# Altium project 3DAS_4Camera.PrjPcb (part 10 of 10)
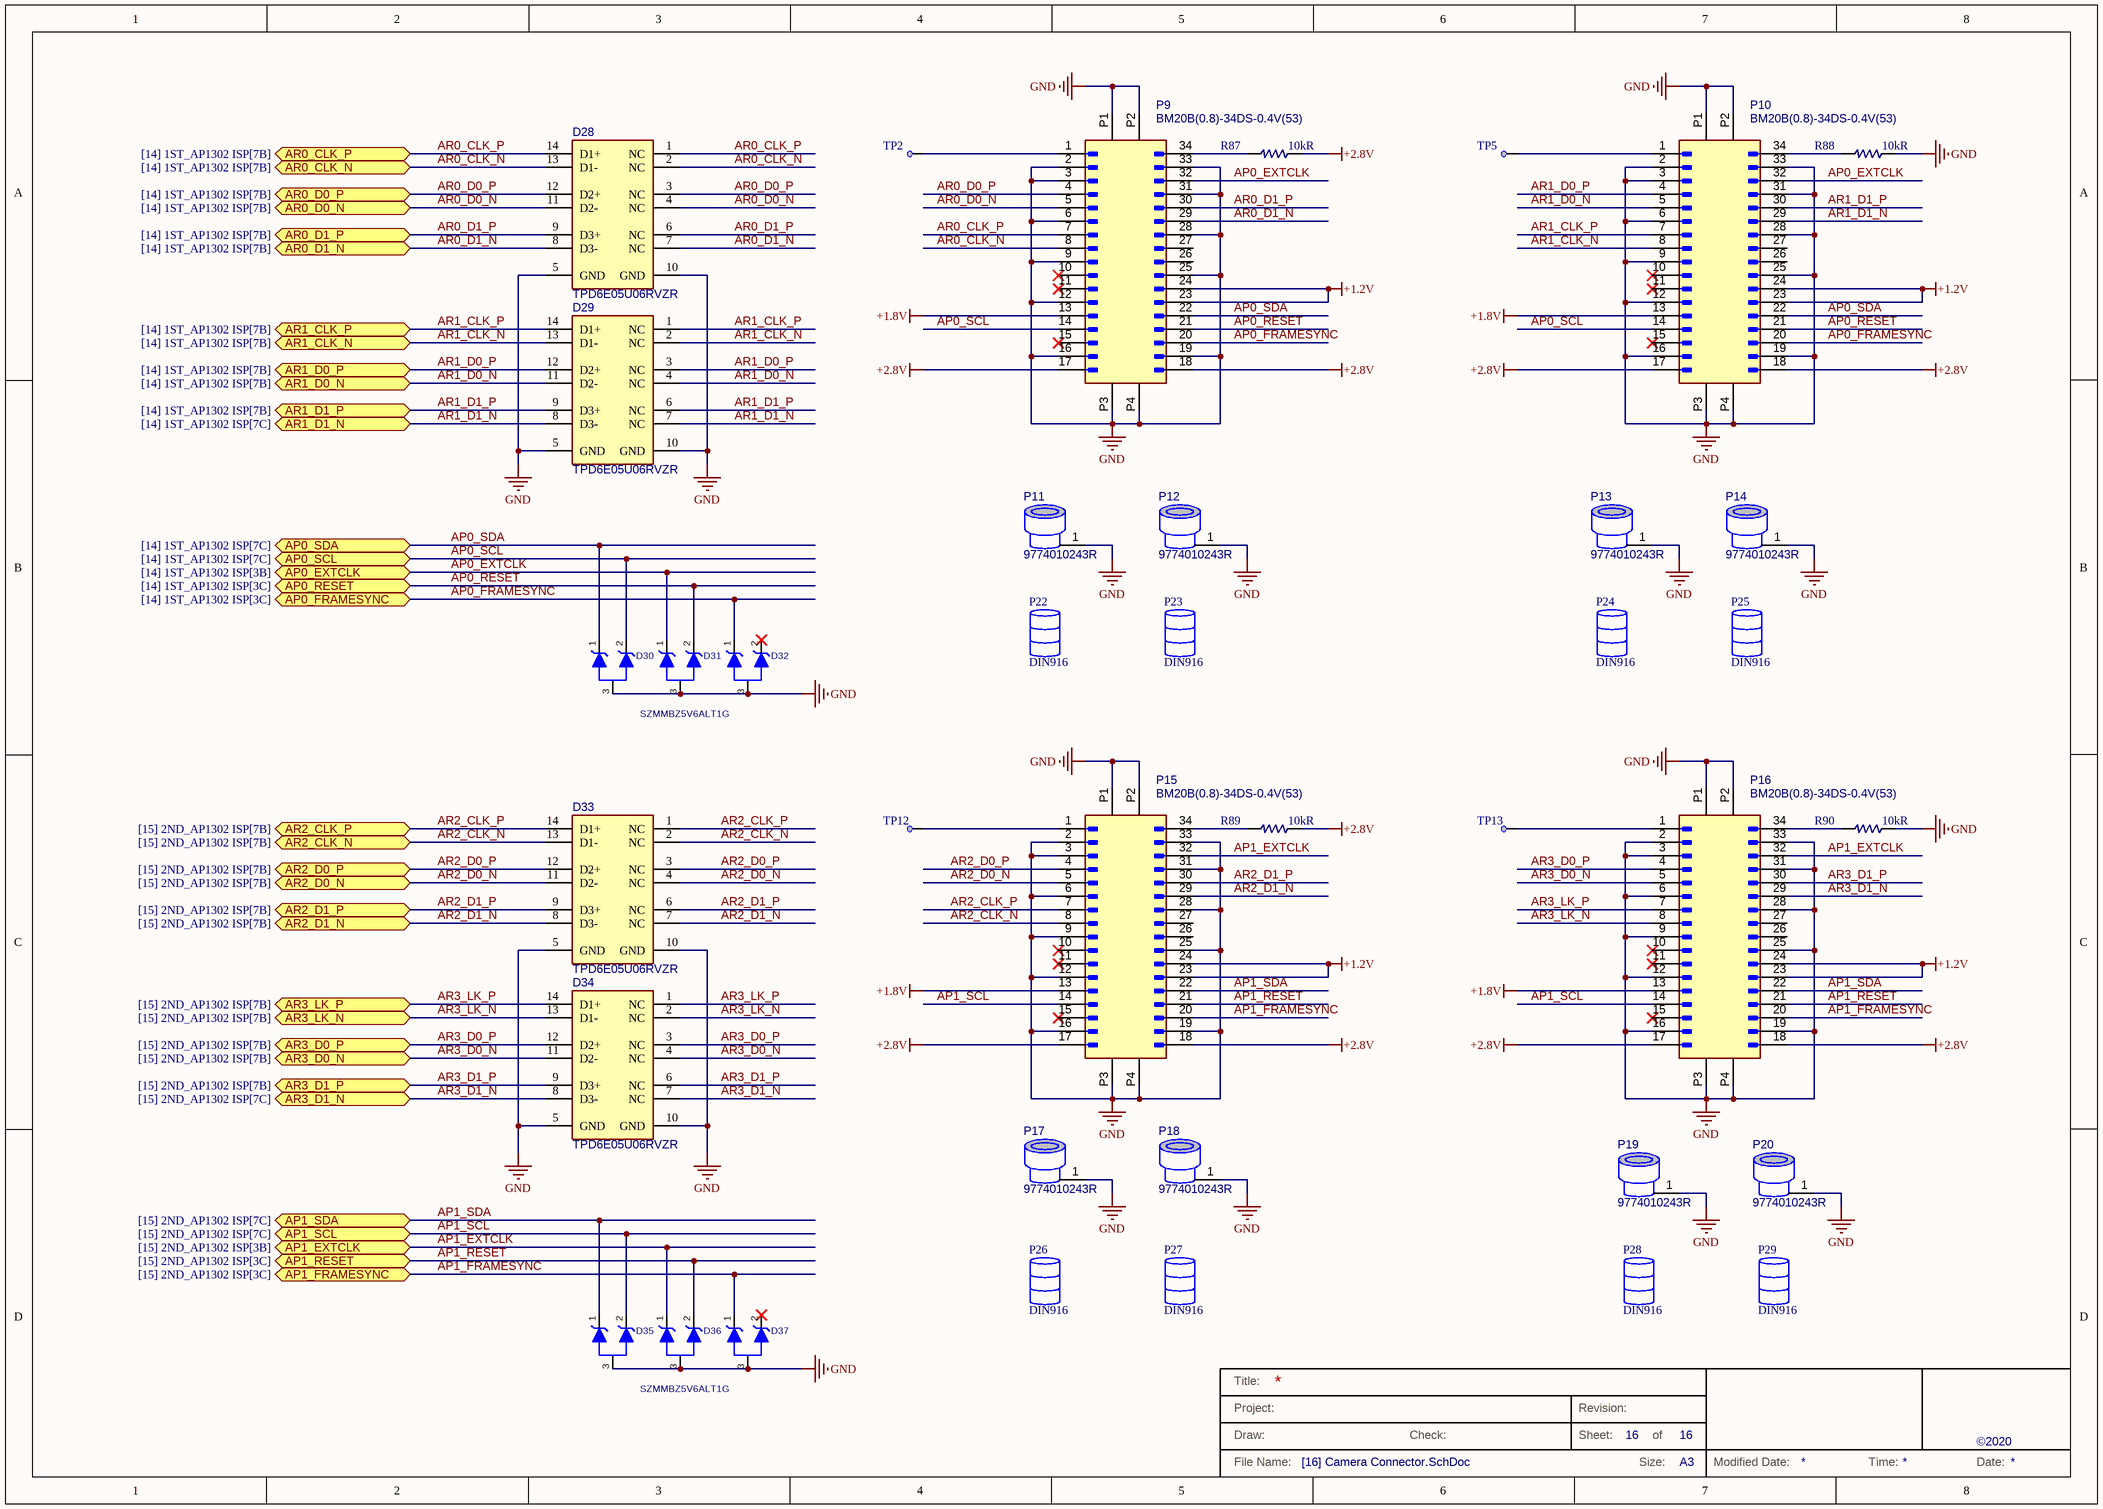
[diagram p17: [16] Camera Connector.SchDoc]

## Nets that join several sheets
1.2V_AP: [14] 1ST_AP1302 ISP (20 pins), [15] 2ND_AP1302 ISP (17 pins)
1.2V_CORE1: [14] 1ST_AP1302 ISP (19 pins), [15] 2ND_AP1302 ISP (19 pins)
+1.2V: [3] Power Supply (C23.1 R38.2 R98.1 TP10.1), [14] 1ST_AP1302 ISP (C82.1 FB18.2), [16] Camera Connector (8 pins)
+1.8V: [3] Power Supply (C19.1 R37.2 R97.1 TP9.1), [5] Jetson Nano P1 (C49.2 R28.2 U15.1), [10] Peripheral (R47.1 R48.2), [14] 1ST_AP1302 ISP (C76.1 FB17.2), [16] Camera Connector (P9.13 P10.13 P15.13 P16.13)
+2.8V: [3] Power Supply (6 pins), [16] Camera Connector (10 pins)
+3.3V: [3] Power Supply (15 pins), [5] Jetson Nano P1 (C50.2 D3.2 U15.8), [6] Jetson Nano P2 (R59.2 R64.2), [8] RJ45 Connector (C8.2 J9.9 J9.11), [10] Peripheral (12 pins), [11] HUB USB3.0 (Q8.1), [14] 1ST_AP1302 ISP (7 pins), [15] 2ND_AP1302 ISP (R83.1)
+5V: [3] Power Supply (5 pins), [4] Power ON_OFF (16 pins), [5] Jetson Nano P1 (15 pins), [10] Peripheral (C2.1 D15.3 J2.2 R32.1), [11] HUB USB3.0 (C53.1 C54.2 U2.53 U2.54), [12] USB3.0_Connector1&2 (FB16.2)
AP_1V8: [10] Peripheral (R6.1 R7.1 R8.1 R14.1), [14] 1ST_AP1302 ISP (8 pins), [15] 2ND_AP1302 ISP (6 pins)
AP_1V8_FIRST: [14] 1ST_AP1302 ISP (10 pins), [15] 2ND_AP1302 ISP (6 pins)
GND: [3] Power Supply (26 pins), [4] Power ON_OFF (18 pins), [5] Jetson Nano P1 (88 pins), [8] RJ45 Connector (9 pins), [9] USB 2.0  (9 pins), [10] Peripheral (36 pins), [11] HUB USB3.0 (31 pins), [12] USB3.0_Connector1&2 (28 pins), [13] USB3.0_Connector3&4 (18 pins), [14] 1ST_AP1302 ISP (68 pins), [15] 2ND_AP1302 ISP (56 pins), [16] Camera Connector (84 pins)
VDD_USB_VBUSTYPEA: [12] USB3.0_Connector1&2 (6 pins), [13] USB3.0_Connector3&4 (J11.1 J11.10)
AP0_EXTCLK: [14] 1ST_AP1302 ISP (U20.B10), [16] Camera Connector (D31.1 P9.32 P10.32)
AP0_FRAMESYNC: [14] 1ST_AP1302 ISP (U20.A10), [16] Camera Connector (D32.1 P9.20 P10.20)
AP0_RESET: [14] 1ST_AP1302 ISP (U20.C10), [16] Camera Connector (D31.2 P9.21 P10.21)
AP0_RST: [6] Jetson Nano P2 (U14.127), [14] 1ST_AP1302 ISP (R73.1 R74.1)
AP0_SCL: [14] 1ST_AP1302 ISP (R56.2 U20.B11), [16] Camera Connector (D30.2 P9.14 P10.14)
AP0_SDA: [14] 1ST_AP1302 ISP (R55.2 U20.C11), [16] Camera Connector (D30.1 P9.22 P10.22)
AP0_STANDBY: [6] Jetson Nano P2 (U14.114), [14] 1ST_AP1302 ISP (Q15.2 R65.2)
AP0_TRIGGER: [10] Peripheral (D24.2 P21.2), [14] 1ST_AP1302 ISP (U20.M5)
AP1_CLK: [14] 1ST_AP1302 ISP (U18.8), [15] 2ND_AP1302 ISP (U21.M2)
AP1_EXTCLK: [15] 2ND_AP1302 ISP (U21.B10), [16] Camera Connector (D36.1 P15.32 P16.32)
AP1_FRAMESYNC: [15] 2ND_AP1302 ISP (U21.A10), [16] Camera Connector (D37.1 P15.20 P16.20)
AP1_RESET: [15] 2ND_AP1302 ISP (U21.C10), [16] Camera Connector (D36.2 P15.21 P16.21)
AP1_RST: [6] Jetson Nano P2 (U14.128), [15] 2ND_AP1302 ISP (R85.1 R86.1)
AP1_SCL: [15] 2ND_AP1302 ISP (R80.2 U21.B11), [16] Camera Connector (D35.2 P15.14 P16.14)
AP1_SDA: [15] 2ND_AP1302 ISP (R79.2 U21.C11), [16] Camera Connector (D35.1 P15.22 P16.22)
AP1_STANDBY: [6] Jetson Nano P2 (U14.120), [15] 2ND_AP1302 ISP (Q17.2 R83.2)
AP1_TRIGGER: [10] Peripheral (P21.4), [15] 2ND_AP1302 ISP (U21.M5)
AP1302_0 AR SCL: [10] Peripheral (IC2.5 R7.2), [14] 1ST_AP1302 ISP (U20.C12)
AP1302_0 AR SDA: [10] Peripheral (IC2.4 R6.2), [14] 1ST_AP1302 ISP (U20.D12)
AP1302_1 AR SCL: [10] Peripheral (IC2.7 R14.2), [15] 2ND_AP1302 ISP (U21.C12)
AP1302_1 AR SDA: [10] Peripheral (IC2.6 R8.2), [15] 2ND_AP1302 ISP (U21.D12)
AR0_CLK_N: [14] 1ST_AP1302 ISP (U20.B4), [16] Camera Connector (D28.2 D28.13 P9.8)
AR0_CLK_P: [14] 1ST_AP1302 ISP (U20.A4), [16] Camera Connector (D28.1 D28.14 P9.7)
AR0_D0_N: [14] 1ST_AP1302 ISP (U20.B2), [16] Camera Connector (D28.4 D28.11 P9.5)
AR0_D0_P: [14] 1ST_AP1302 ISP (U20.A2), [16] Camera Connector (D28.3 D28.12 P9.4)
AR0_D1_N: [14] 1ST_AP1302 ISP (U20.B3), [16] Camera Connector (D28.7 D28.8 P9.29)
AR0_D1_P: [14] 1ST_AP1302 ISP (U20.A3), [16] Camera Connector (D28.6 D28.9 P9.30)
AR1_CLK_N: [14] 1ST_AP1302 ISP (U20.B7), [16] Camera Connector (D29.2 D29.13 P10.8)
AR1_CLK_P: [14] 1ST_AP1302 ISP (U20.A7), [16] Camera Connector (D29.1 D29.14 P10.7)
AR1_D0_N: [14] 1ST_AP1302 ISP (U20.B8), [16] Camera Connector (D29.4 D29.11 P10.5)
AR1_D0_P: [14] 1ST_AP1302 ISP (U20.A8), [16] Camera Connector (D29.3 D29.12 P10.4)
AR1_D1_N: [14] 1ST_AP1302 ISP (U20.B9), [16] Camera Connector (D29.7 D29.8 P10.29)
AR1_D1_P: [14] 1ST_AP1302 ISP (U20.A9), [16] Camera Connector (D29.6 D29.9 P10.30)
AR2_CLK_N: [15] 2ND_AP1302 ISP (U21.B4), [16] Camera Connector (D33.2 D33.13 P15.8)
AR2_CLK_P: [15] 2ND_AP1302 ISP (U21.A4), [16] Camera Connector (D33.1 D33.14 P15.7)
AR2_D0_N: [15] 2ND_AP1302 ISP (U21.B2), [16] Camera Connector (D33.4 D33.11 P15.5)
AR2_D0_P: [15] 2ND_AP1302 ISP (U21.A2), [16] Camera Connector (D33.3 D33.12 P15.4)
AR2_D1_N: [15] 2ND_AP1302 ISP (U21.B3), [16] Camera Connector (D33.7 D33.8 P15.29)
AR2_D1_P: [15] 2ND_AP1302 ISP (U21.A3), [16] Camera Connector (D33.6 D33.9 P15.30)
AR3_D0_N: [15] 2ND_AP1302 ISP (U21.B8), [16] Camera Connector (D34.4 D34.11 P16.5)
AR3_D0_P: [15] 2ND_AP1302 ISP (U21.A8), [16] Camera Connector (D34.3 D34.12 P16.4)
AR3_D1_N: [15] 2ND_AP1302 ISP (U21.B9), [16] Camera Connector (D34.7 D34.8 P16.29)
AR3_D1_P: [15] 2ND_AP1302 ISP (U21.A9), [16] Camera Connector (D34.6 D34.9 P16.30)
AR3_LK_N: [15] 2ND_AP1302 ISP (U21.B7), [16] Camera Connector (D34.2 D34.13 P16.8)
AR3_LK_P: [15] 2ND_AP1302 ISP (U21.A7), [16] Camera Connector (D34.1 D34.14 P16.7)
CAM_I2C_SCL: [6] Jetson Nano P2 (R59.1 U14.213), [10] Peripheral (IC2.15 R4.2), [11] HUB USB3.0 (U2.32)
CAM_I2C_SDA: [6] Jetson Nano P2 (R64.1 U14.215), [10] Peripheral (IC2.14 R5.2), [11] HUB USB3.0 (U2.33)
CSI0_CLK_N: [6] Jetson Nano P2 (U14.10), [14] 1ST_AP1302 ISP (U20.M7)
CSI0_CLK_P: [6] Jetson Nano P2 (U14.12), [14] 1ST_AP1302 ISP (U20.L7)
CSI0_D0_N: [6] Jetson Nano P2 (U14.4), [14] 1ST_AP1302 ISP (U20.M11)
CSI0_D0_P: [6] Jetson Nano P2 (U14.6), [14] 1ST_AP1302 ISP (U20.L11)
CSI0_D1_N: [6] Jetson Nano P2 (U14.16), [14] 1ST_AP1302 ISP (U20.M10)
CSI0_D1_P: [6] Jetson Nano P2 (U14.18), [14] 1ST_AP1302 ISP (U20.L10)
CSI0_D2_N: [6] Jetson Nano P2 (U14.3), [14] 1ST_AP1302 ISP (U20.M9)
CSI0_D2_P: [6] Jetson Nano P2 (U14.5), [14] 1ST_AP1302 ISP (U20.L9)
CSI0_D3_N: [6] Jetson Nano P2 (U14.15), [14] 1ST_AP1302 ISP (U20.M8)
CSI0_D3_P: [6] Jetson Nano P2 (U14.17), [14] 1ST_AP1302 ISP (U20.L8)
CSI2_CLK_N: [6] Jetson Nano P2 (U14.28), [15] 2ND_AP1302 ISP (U21.M7)
CSI2_CLK_P: [6] Jetson Nano P2 (U14.30), [15] 2ND_AP1302 ISP (U21.L7)
CSI2_D0_N: [6] Jetson Nano P2 (U14.22), [15] 2ND_AP1302 ISP (U21.M11)
CSI2_D0_P: [6] Jetson Nano P2 (U14.24), [15] 2ND_AP1302 ISP (U21.L11)
CSI2_D1_N: [6] Jetson Nano P2 (U14.34), [15] 2ND_AP1302 ISP (U21.M10)
CSI2_D1_P: [6] Jetson Nano P2 (U14.36), [15] 2ND_AP1302 ISP (U21.L10)
CSI3_D0_N: [6] Jetson Nano P2 (U14.21), [15] 2ND_AP1302 ISP (U21.M9)
CSI3_D0_P: [6] Jetson Nano P2 (U14.23), [15] 2ND_AP1302 ISP (U21.L9)
CSI3_D1_N: [6] Jetson Nano P2 (U14.33), [15] 2ND_AP1302 ISP (U21.M8)
CSI3_D1_P: [6] Jetson Nano P2 (U14.35), [15] 2ND_AP1302 ISP (U21.L8)
DSP1_D_N: [11] HUB USB3.0 (U2.72), [12] USB3.0_Connector1&2 (D5.5 D5.6 U6.6)
DSP1_D_P: [11] HUB USB3.0 (U2.71), [12] USB3.0_Connector1&2 (D5.4 D5.7 U6.5)
DSP1_SSRX_N: [11] HUB USB3.0 (U2.69), [12] USB3.0_Connector1&2 (D5.1 D5.10 J3.14)
DSP1_SSRX_P: [11] HUB USB3.0 (U2.68), [12] USB3.0_Connector1&2 (D5.2 D5.9 J3.15)
DSP1_SSTX_N: [11] HUB USB3.0 (U2.66), [12] USB3.0_Connector1&2 (C64.1 D19.5 D19.6)
DSP1_SSTX_P: [11] HUB USB3.0 (U2.65), [12] USB3.0_Connector1&2 (C65.1 D19.4 D19.7)
DSP2_D_N: [11] HUB USB3.0 (U2.6), [12] USB3.0_Connector1&2 (D19.1 D19.10 U7.6)
DSP2_D_P: [11] HUB USB3.0 (U2.5), [12] USB3.0_Connector1&2 (D19.2 D19.9 U7.5)
DSP2_SSRX_N: [11] HUB USB3.0 (U2.12), [12] USB3.0_Connector1&2 (D6.5 D6.6 J3.5)
DSP2_SSRX_P: [11] HUB USB3.0 (U2.11), [12] USB3.0_Connector1&2 (D6.4 D6.7 J3.6)
DSP2_SSTX_N: [11] HUB USB3.0 (U2.9), [12] USB3.0_Connector1&2 (C66.1 D6.2 D6.9)
DSP2_SSTX_P: [11] HUB USB3.0 (U2.8), [12] USB3.0_Connector1&2 (C67.1 D6.1 D6.10)
DSP3_D_N: [11] HUB USB3.0 (U2.21), [13] USB3.0_Connector3&4 (D20.5 D20.6 U8.6)
DSP3_D_P: [11] HUB USB3.0 (U2.20), [13] USB3.0_Connector3&4 (D20.4 D20.7 U8.5)
DSP3_SSRX_N: [11] HUB USB3.0 (U2.18), [13] USB3.0_Connector3&4 (D20.1 D20.10 J11.14)
DSP3_SSRX_P: [11] HUB USB3.0 (U2.17), [13] USB3.0_Connector3&4 (D20.2 D20.9 J11.15)
DSP3_SSTX_N: [11] HUB USB3.0 (U2.15), [13] USB3.0_Connector3&4 (C68.1 D22.5 D22.6)
DSP3_SSTX_P: [11] HUB USB3.0 (U2.14), [13] USB3.0_Connector3&4 (C69.1 D22.4 D22.7)
DSP4_D_N: [11] HUB USB3.0 (U2.24), [13] USB3.0_Connector3&4 (D22.1 D22.10 U16.6)
DSP4_D_P: [11] HUB USB3.0 (U2.23), [13] USB3.0_Connector3&4 (D22.2 D22.9 U16.5)
DSP4_SSRX_N: [11] HUB USB3.0 (U2.30), [13] USB3.0_Connector3&4 (D21.5 D21.6 J11.5)
DSP4_SSRX_P: [11] HUB USB3.0 (U2.29), [13] USB3.0_Connector3&4 (D21.4 D21.7 J11.6)
DSP4_SSTX_N: [11] HUB USB3.0 (U2.27), [13] USB3.0_Connector3&4 (C70.1 D21.2 D21.9)
DSP4_SSTX_P: [11] HUB USB3.0 (U2.26), [13] USB3.0_Connector3&4 (C71.1 D21.1 D21.10)
DSP1234_PWR: [11] HUB USB3.0 (U2.40), [12] USB3.0_Connector1&2 (R13.1 U3.2)
FAN-PWM: [6] Jetson Nano P2 (U14.230), [10] Peripheral (Q13.1 R48.1)
FAN-TACH: [6] Jetson Nano P2 (U14.208), [10] Peripheral (Q14.3 R47.2)
FORCE_OFF: [4] Power ON_OFF (U13.2), [5] Jetson Nano P1 (U14.233), [10] Peripheral (D10.2 P21.7)
GBE_LED_ACT: [6] Jetson Nano P2 (U14.194), [8] RJ45 Connector (R12.2)
GBE_LED_LINK: [6] Jetson Nano P2 (U14.188), [8] RJ45 Connector (R11.1)
GBE_MDI0_N: [6] Jetson Nano P2 (U14.184), [8] RJ45 Connector (D16.4 D16.7 J9.2)
GBE_MDI0_P: [6] Jetson Nano P2 (U14.186), [8] RJ45 Connector (D16.5 D16.6 J9.1)
GBE_MDI1_N: [6] Jetson Nano P2 (U14.190), [8] RJ45 Connector (D16.1 D16.10 J9.4)
GBE_MDI1_P: [6] Jetson Nano P2 (U14.192), [8] RJ45 Connector (D16.2 D16.9 J9.3)
GBE_MDI2_N: [6] Jetson Nano P2 (U14.196), [8] RJ45 Connector (D14.4 D14.7 J9.6)
GBE_MDI2_P: [6] Jetson Nano P2 (U14.198), [8] RJ45 Connector (D14.5 D14.6 J9.5)
GBE_MDI3_N: [6] Jetson Nano P2 (U14.202), [8] RJ45 Connector (D14.1 D14.10 J9.8)
GBE_MDI3_P: [6] Jetson Nano P2 (U14.204), [8] RJ45 Connector (D14.2 D14.9 J9.7)
I2C_SW_RST: [6] Jetson Nano P2 (U14.206), [10] Peripheral (R30.1 R31.1)
LATCH_SET: [4] Power ON_OFF (5 pins), [5] Jetson Nano P1 (DZ6.2 J12.6)
LATCH_SET_BUT: [4] Power ON_OFF (R18.1 R20.1 U10.4), [5] Jetson Nano P1 (DZ7.2 J12.5)
LED_BLUE: [6] Jetson Nano P2 (U14.124), [10] Peripheral (R72.2)
LED_GREEN: [6] Jetson Nano P2 (U14.118), [10] Peripheral (R71.2)
LED_RED: [6] Jetson Nano P2 (U14.126), [10] Peripheral (R70.2)
POWER_EN: [4] Power ON_OFF (R17.2 TP4.1 U9.4), [5] Jetson Nano P1 (U14.237), [10] Peripheral (D10.1 P21.5)
PWR_BTN: [4] Power ON_OFF (Q2.1 U10.2), [5] Jetson Nano P1 (7 pins)
SDMMC_CLK: [6] Jetson Nano P2 (U14.229), [10] Peripheral (R63.1)
SDMMC_CMD: [6] Jetson Nano P2 (U14.227), [10] Peripheral (R62.1)
SDMMC_D0: [6] Jetson Nano P2 (U14.219), [10] Peripheral (R66.1)
SDMMC_D1: [6] Jetson Nano P2 (U14.221), [10] Peripheral (R67.1)
SDMMC_D2: [6] Jetson Nano P2 (U14.223), [10] Peripheral (R60.1)
SDMMC_D3: [6] Jetson Nano P2 (U14.225), [10] Peripheral (R61.1)
SYS_RST: [3] Power Supply (R1.2), [5] Jetson Nano P1 (DZ8.2 J12.4 U14.239), [10] Peripheral (D23.1 P21.10)
USB0_AP_N: [6] Jetson Nano P2 (U14.109), [9] USB 2.0  (D17.1 J10.2)
USB0_AP_P: [6] Jetson Nano P2 (U14.111), [9] USB 2.0  (D18.1 J10.3)
USB0_VBUS_DET: [6] Jetson Nano P2 (U14.87), [9] USB 2.0  (Q3.3 TP11.1)
USB1_AP_N: [6] Jetson Nano P2 (U14.115), [11] HUB USB3.0 (U2.57)
USB1_AP_P: [6] Jetson Nano P2 (U14.117), [11] HUB USB3.0 (U2.56)
USB_TYPEA_OCP: [11] HUB USB3.0 (5 pins), [12] USB3.0_Connector1&2 (U3.6)
USBSS_TX6_HUB_N: [7] Jetson Nano P3 (C5.2), [11] HUB USB3.0 (U2.59)
USBSS_TX6_HUB_P: [7] Jetson Nano P3 (C4.2), [11] HUB USB3.0 (U2.60)
USBSS_TX6_N: [7] Jetson Nano P3 (U14.166), [11] HUB USB3.0 (C32.2)
USBSS_TX6_P: [7] Jetson Nano P3 (U14.168), [11] HUB USB3.0 (C33.2)

## Assembly variants
Basic Option: not fitted R19 R20 U9